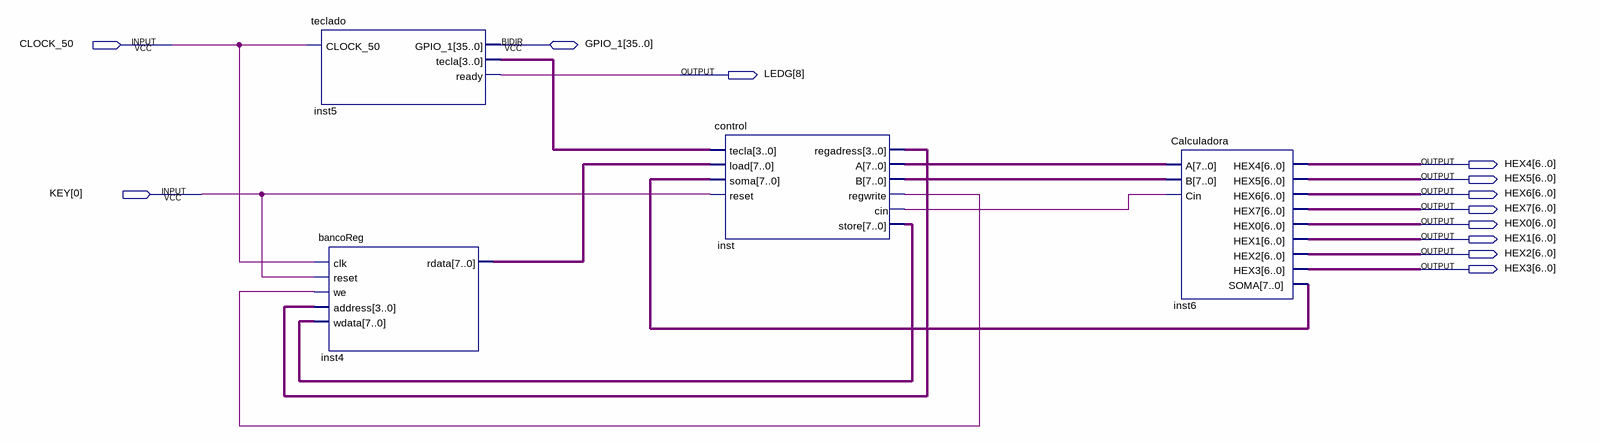
[diagram p0: schematic sheet]
// Quartus schematic ProjFinal.bdf as structural Verilog: 4 symbols, 12 pins
module ProjFinal (
  input  CLOCK_50,
  input  [0:0] KEY,
  inout  [35:0] GPIO_1,
  output [8:8] LEDG,
  output [6:0] HEX4,
  output [6:0] HEX5,
  output [6:0] HEX6,
  output [6:0] HEX7,
  output [6:0] HEX0,
  output [6:0] HEX1,
  output [6:0] HEX2,
  output [6:0] HEX3
);

  wire inst_cin, inst_regwrite;
  wire [3:0] inst5_tecla, inst_regadress;
  wire [7:0] inst4_rdata, inst6_soma, inst_a, inst_b, inst_store;

  teclado inst5 (.CLOCK_50(CLOCK_50), .tecla(inst5_tecla), .ready(LEDG[8]), .GPIO_1(GPIO_1));
  bancoReg inst4 (
    .clk(CLOCK_50), .reset(KEY[0]), .we(inst_regwrite), .address(inst_regadress), .wdata(inst_store),
    .rdata(inst4_rdata));
  control inst (
    .tecla(inst5_tecla), .load(inst4_rdata), .soma(inst6_soma), .reset(KEY[0]), .regadress(inst_regadress),
    .A(inst_a), .B(inst_b), .regwrite(inst_regwrite), .cin(inst_cin), .store(inst_store));
  Calculadora inst6 (
    .A(inst_a), .B(inst_b), .Cin(inst_cin), .HEX4(HEX4), .HEX5(HEX5), .HEX6(HEX6), .HEX7(HEX7), .HEX0(HEX0),
    .HEX1(HEX1), .HEX2(HEX2), .HEX3(HEX3), .SOMA(inst6_soma));
endmodule
